# EAGLE design rapidshark-flywheel-controller-mk-1.4 (EAGLE 6.5.0)
AUTHOR: sean@yak.net
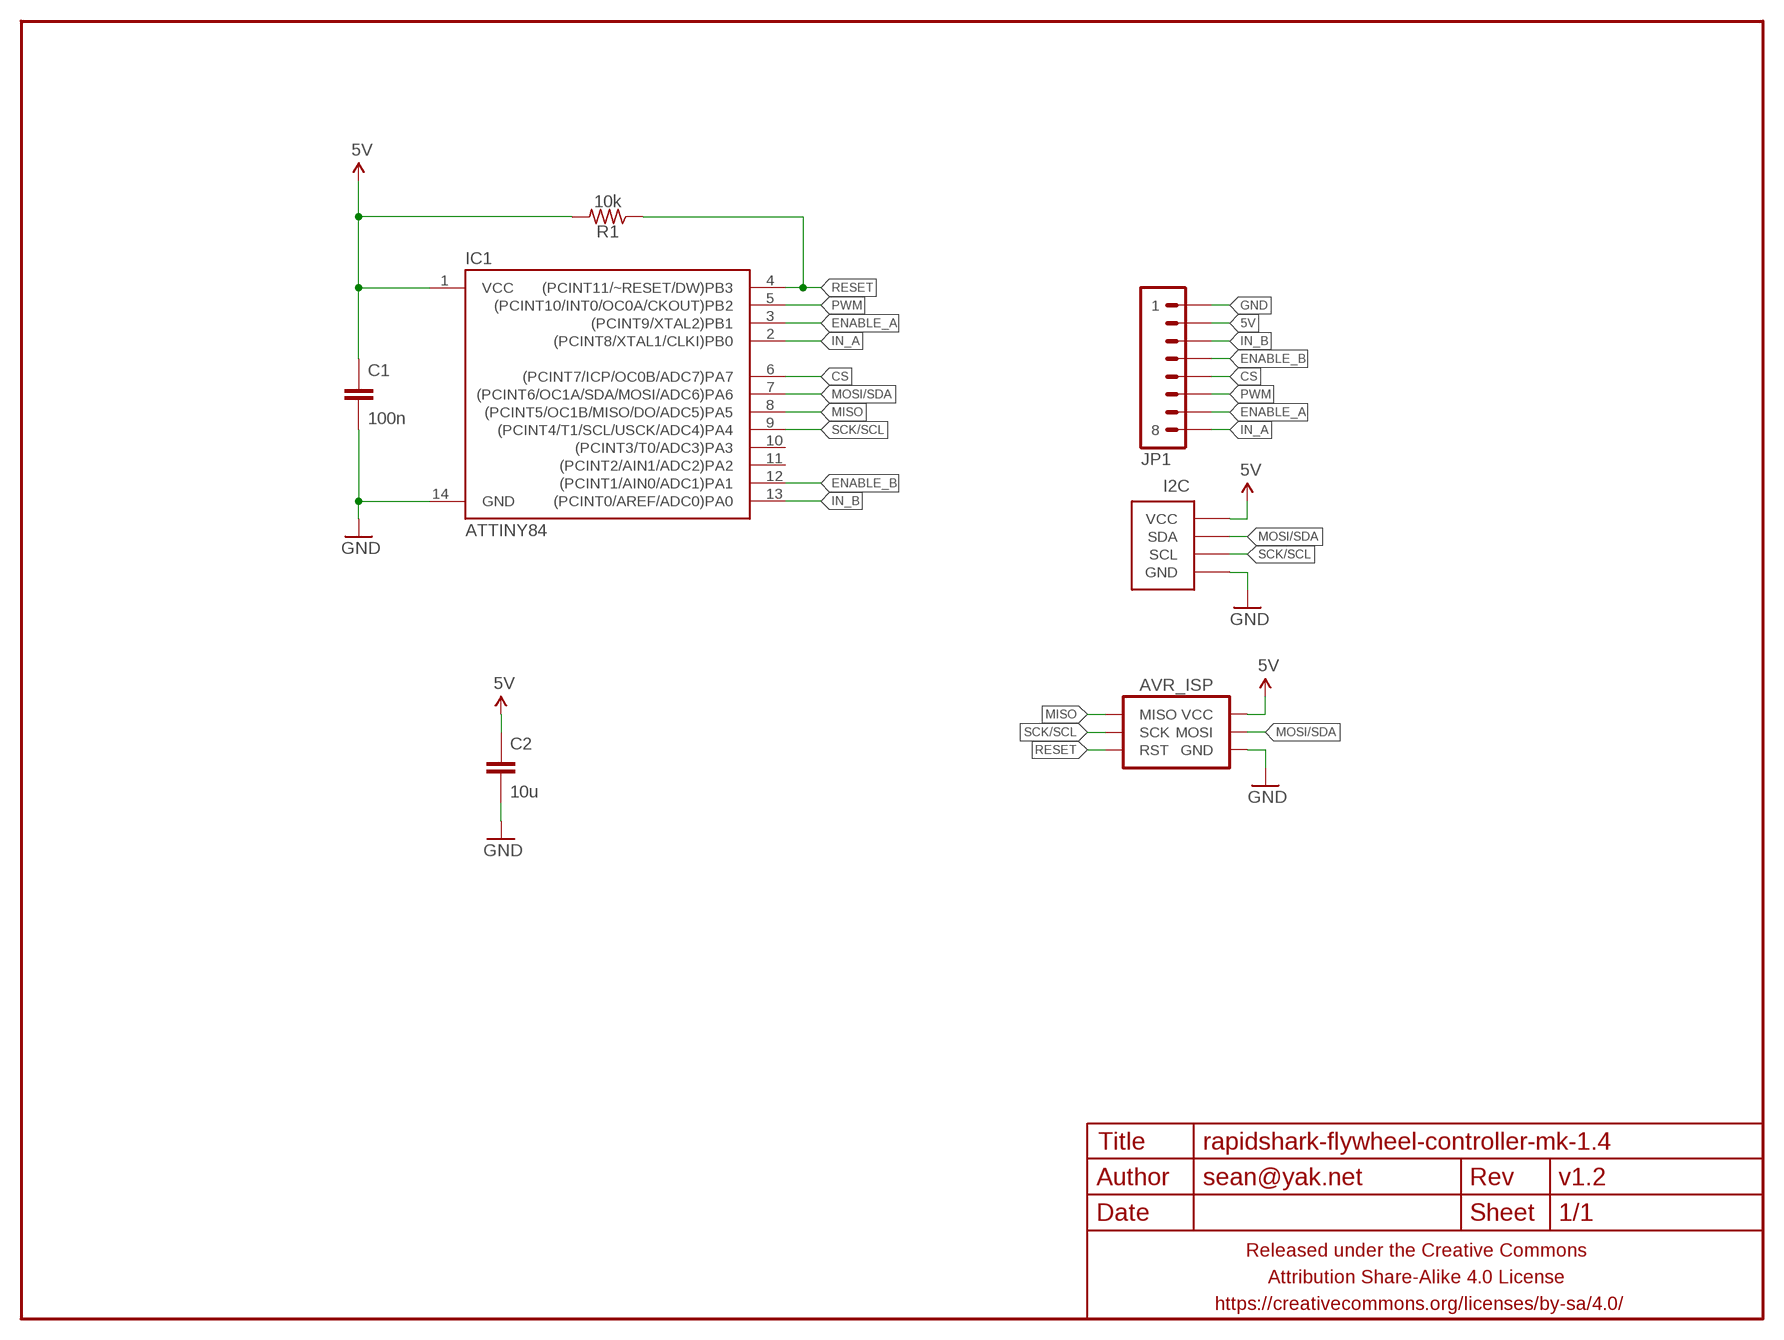
[diagram p0: schematic, sheet 1]

## Parts
AVR_ISP  AVR_SPI_PRG_6PTH  [2X3]
C1  100n  CAPACITOR-CERAMICPTH-RAD-2.54MM  [CAPCER-RAD-PTH-2.54MM]
C2  10u  CAPACITOR-CERAMICPTH-RAD-5.08MM  [CAPCER-RAD-PTH-5.08MM]
FRAME1  FRAME-LETTERNO_PACKAGE  [DUMMY]
I2C  M04-I2CJST-4-PH-RA-CENTERED  [1X04-JST-PH-RA-PTH-I2C-CENTERED]
IC1  ATTINY84  [SO14]
JP1  M081X08  [1X08]
R1  10k  RESISTORPTH-AXIAL-5.08MM  [RESISTOR-AXIAL-PTH-5.08MM]

## Nets
5V: AVR_ISP.2(VCC) C1.1 C2.1 I2C.2(VCC) IC1.1(VCC) JP1.2 R1.P$2
CS: IC1.6((PCINT7/ICP/OC0B/ADC7)PA7) JP1.5
ENABLE_A: IC1.3((PCINT9/XTAL2)PB1) JP1.7
ENABLE_B: IC1.12((PCINT1/AIN0/ADC1)PA1) JP1.4
GND: AVR_ISP.6(GND) C1.2 C2.2 I2C.1(GND) IC1.14(GND) JP1.1
IN_A: IC1.2((PCINT8/XTAL1/CLKI)PB0) JP1.8
IN_B: IC1.13((PCINT0/AREF/ADC0)PA0) JP1.3
MISO: AVR_ISP.1(MISO) IC1.8((PCINT5/OC1B/MISO/DO/ADC5)PA5)
MOSI/SDA: AVR_ISP.4(MOSI) I2C.3(SDA) IC1.7((PCINT6/OC1A/SDA/MOSI/ADC6)PA6)
PWM: IC1.5((PCINT10/INT0/OC0A/CKOUT)PB2) JP1.6
RESET: AVR_ISP.5(RST) IC1.4((PCINT11/~RESET/DW)PB3) R1.P$1
SCK/SCL: AVR_ISP.3(SCK) I2C.4(SCL) IC1.9((PCINT4/T1/SCL/USCK/ADC4)PA4)
Unconnected: IC1.10((PCINT3/T0/ADC3)PA3) IC1.11((PCINT2/AIN1/ADC2)PA2)

## Library data of the parts
AVR_ISP = A_butts:AVR_SPI_PRG_6: AVR ISP 6 Pin This is the reduced ISP connector for AVR programming. Common on Arduino. This footprint will take up less PCB space and can be used with a 10-pin to 6-pin adapter such as SKU: BOB-08508 **Special note about "TEST_POINT" package. The stop mask is on the top side, so if you want your programming test points to be on the bottom of your board, make sure to place this package on the bottom side of the board. This also ensure that the orientation to program from the bottom side will be correct.
C1 C2 = A_butts:CAPACITOR-CERAMIC: CAPACITOR, European symbol
FRAME1 = A_butts:FRAME-LETTER: Schematic Frame Standard 8.5x11 US Letter frame; DESIGNER: sean@yak.net; VERSION: v1.2
I2C = A_butts:M04-I2C
IC1 = A_butts:ATTINY84: Atmel 14-pin 2/4/8kB flash uC
JP1 = A_butts:M08: Header 8 Standard 8-pin 0.1" header. Use with straight break away headers (SKU : PRT-00116), right angle break away headers (PRT-00553), swiss pins (PRT-00743), machine pins (PRT-00117), and female headers (PRT-00115).
R1 = A_butts:RESISTOR: RESISTOR, American symbol

## Board
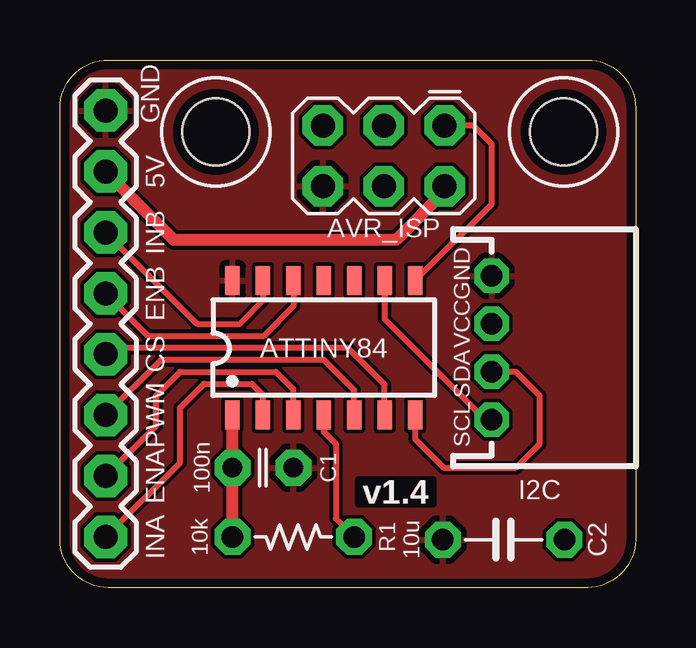
[diagram p1: board, top side]
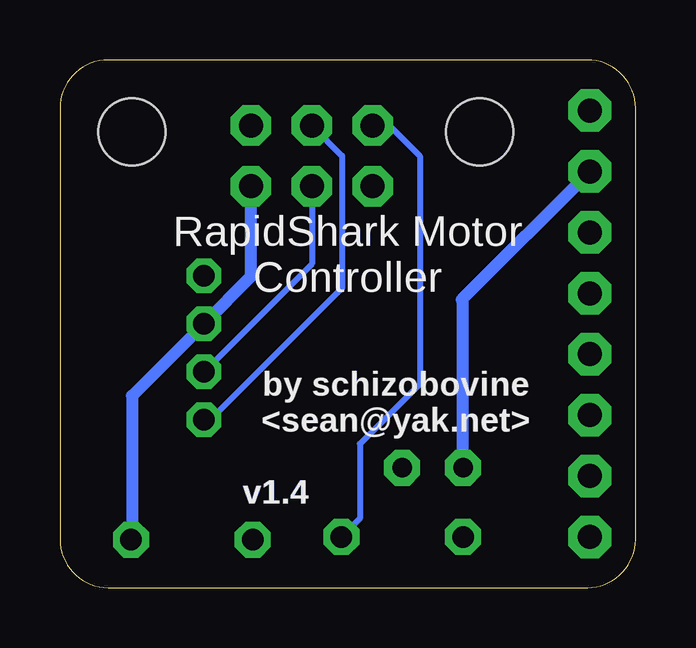
[diagram p2: board, bottom side, seen from below]

Size 24 x 22 mm. Coordinates in mm from the lower left corner, seen from the top.
Outline: 24,20 24,2 arc-90 22,0 2,0 arc-90 0,2 0,20 arc-90 2,22 22,22 arc-90 24,20
Copper layers (1*16): Top 0.0356mm / dielectric 1.5011mm / Bottom 0.0356mm
Design rules "LaenPCBOrder_2": minimum track width 6mil, minimum drill 13mil, track to track 6mil, track to pad 6mil, pad to pad 6mil, via to via 6mil, smd to smd 6mil, copper to edge 15mil, drill to drill 6mil, minimum pad ring 7mil, minimum via ring 7mil, stop-mask expansion 3mil, vias tented up to drill 20mil, thermal gap 10mil
Holes 2.8 mm at 21,19 6.5,19

### Footprints (pad centres in the part's own frame; a part is rotated, then mirrored left to right if it is on the bottom)
2X3 = drill 1 pad 1.676 octagon: 1 -2.54,-1.27; 2 -2.54,1.27; 3 0,-1.27; 4 0,1.27; 5 2.54,-1.27; 6 2.54,1.27
CAPCER-RAD-PTH-2.54MM = drill 0.813 pad 1.5 octagon: 1 -1.27,0; 2 1.27,0
CAPCER-RAD-PTH-5.08MM = drill 0.9 pad 1.5 octagon: 1 -2.54,0; 2 2.54,0
1X04-JST-PH-RA-PTH-I2C-CENTERED = drill 0.9 pad 1.422 octagon: 1 -3,0; 2 -1,0; 3 1,0; 4 3,0
SO14 = smd 0.6 x 1.2: 1 -3.81,-2.8; 2 -2.54,-2.8; 3 -1.27,-2.8; 4 0,-2.8; 5 1.27,-2.8; 6 2.54,-2.8; 7 3.81,-2.8; 8 3.81,2.8; 9 2.54,2.8; 10 1.27,2.8; 11 0,2.8; 12 -1.27,2.8; 13 -2.54,2.8; 14 -3.81,2.8
1X08 = drill 1 pad 1.778 octagon: 1 0,0; 2 2.54,0; 3 5.08,0; 4 7.62,0; 5 10.16,0; 6 12.7,0; 7 15.24,0; 8 17.78,0
RESISTOR-AXIAL-PTH-5.08MM = drill 0.9 pad 1.5 octagon: P$1 -2.54,0; P$2 2.54,0

### Placement (x,y rotation side)
AVR_ISP  13.5,18 180 top
C1  8.46,5 0 top
C2  18.5,2 180 top
FRAME1  0,0 0 bottom
I2C  18,10 270 top
IC1  11,10 0 top
JP1  1.91,19.89 270 top
R1  9.73,2.11 180 top

### Tracks (layer width: path | path; a pad name or v marks a point on that pad's centre or on a via)
5V
  Top 0.5: AVR_ISP.2 16.04,16.54 14,14.5 4.75,14.5 JP1.2 | R1.P$2 C1.1 IC1.1
  Bottom 0.5: C1.1 7.19,12.06 | 7.19,12.06 JP1.2 | 7.19,12.06 7.25,12 | AVR_ISP.2 16.04,12.96 I2C.2 21,8 21,2.04 C2.1
CS
  Top 0.25: IC1.6 13.54,8.46 12,10 2.17,10 JP1.5
ENABLE_A
  Top 0.25: IC1.3 9.73,8.27 9,9 5,9 4,8 4,6.75 JP1.7
ENABLE_B
  Top 0.25: IC1.12 9.73,11.73 8.5,10.5 3.67,10.5 JP1.4
GND
  pour Top (rank 6): 0,0 0,22 24,22 24,0
IN_A
  Top 0.25: JP1.8 5,5.21 5,7.5 6,8.5 8,8.5 8.46,8.04 IC1.2
IN_B
  Top 0.25: IC1.13 8.46,11.96 7.5,11 5.71,11 JP1.3
MISO
  Top 0.25: IC1.8 18,16 18,18.5 17.23,19.27 AVR_ISP.1
MOSI/SDA
  Top 0.25: IC1.7 14.81,6.19 16,5 19,5 20,6 20,8 19,9 I2C.3
  Bottom 0.25: AVR_ISP.4 13.5,13.5 I2C.3
PWM
  Top 0.25: JP1.6 4.21,9.5 11,9.5 12.27,8.23 IC1.5
RESET
  Top 0.25: IC1.4 11,6.5 11.5,6 11.5,2.88 R1.P$1
  Bottom 0.25: AVR_ISP.5 10.27,19.27 9,18 9,8.5 11.5,6 11.5,2.88 R1.P$1
SCK/SCL
  Top 0.25: IC1.9 13.54,11.19 17.73,7 I2C.4
  Bottom 0.25: I2C.4 17.73,7 12.23,12.5 12.23,18 AVR_ISP.3

### Text on the board
tPlace: GND | 5V | INB | ENB | CS | PWM | ENA | INA
bPlace: RapidShark Motor / Controller | by schizobovine / <sean@yak.net>